# EAGLE design In-Palm_Manipulator (EAGLE 9.6.2)
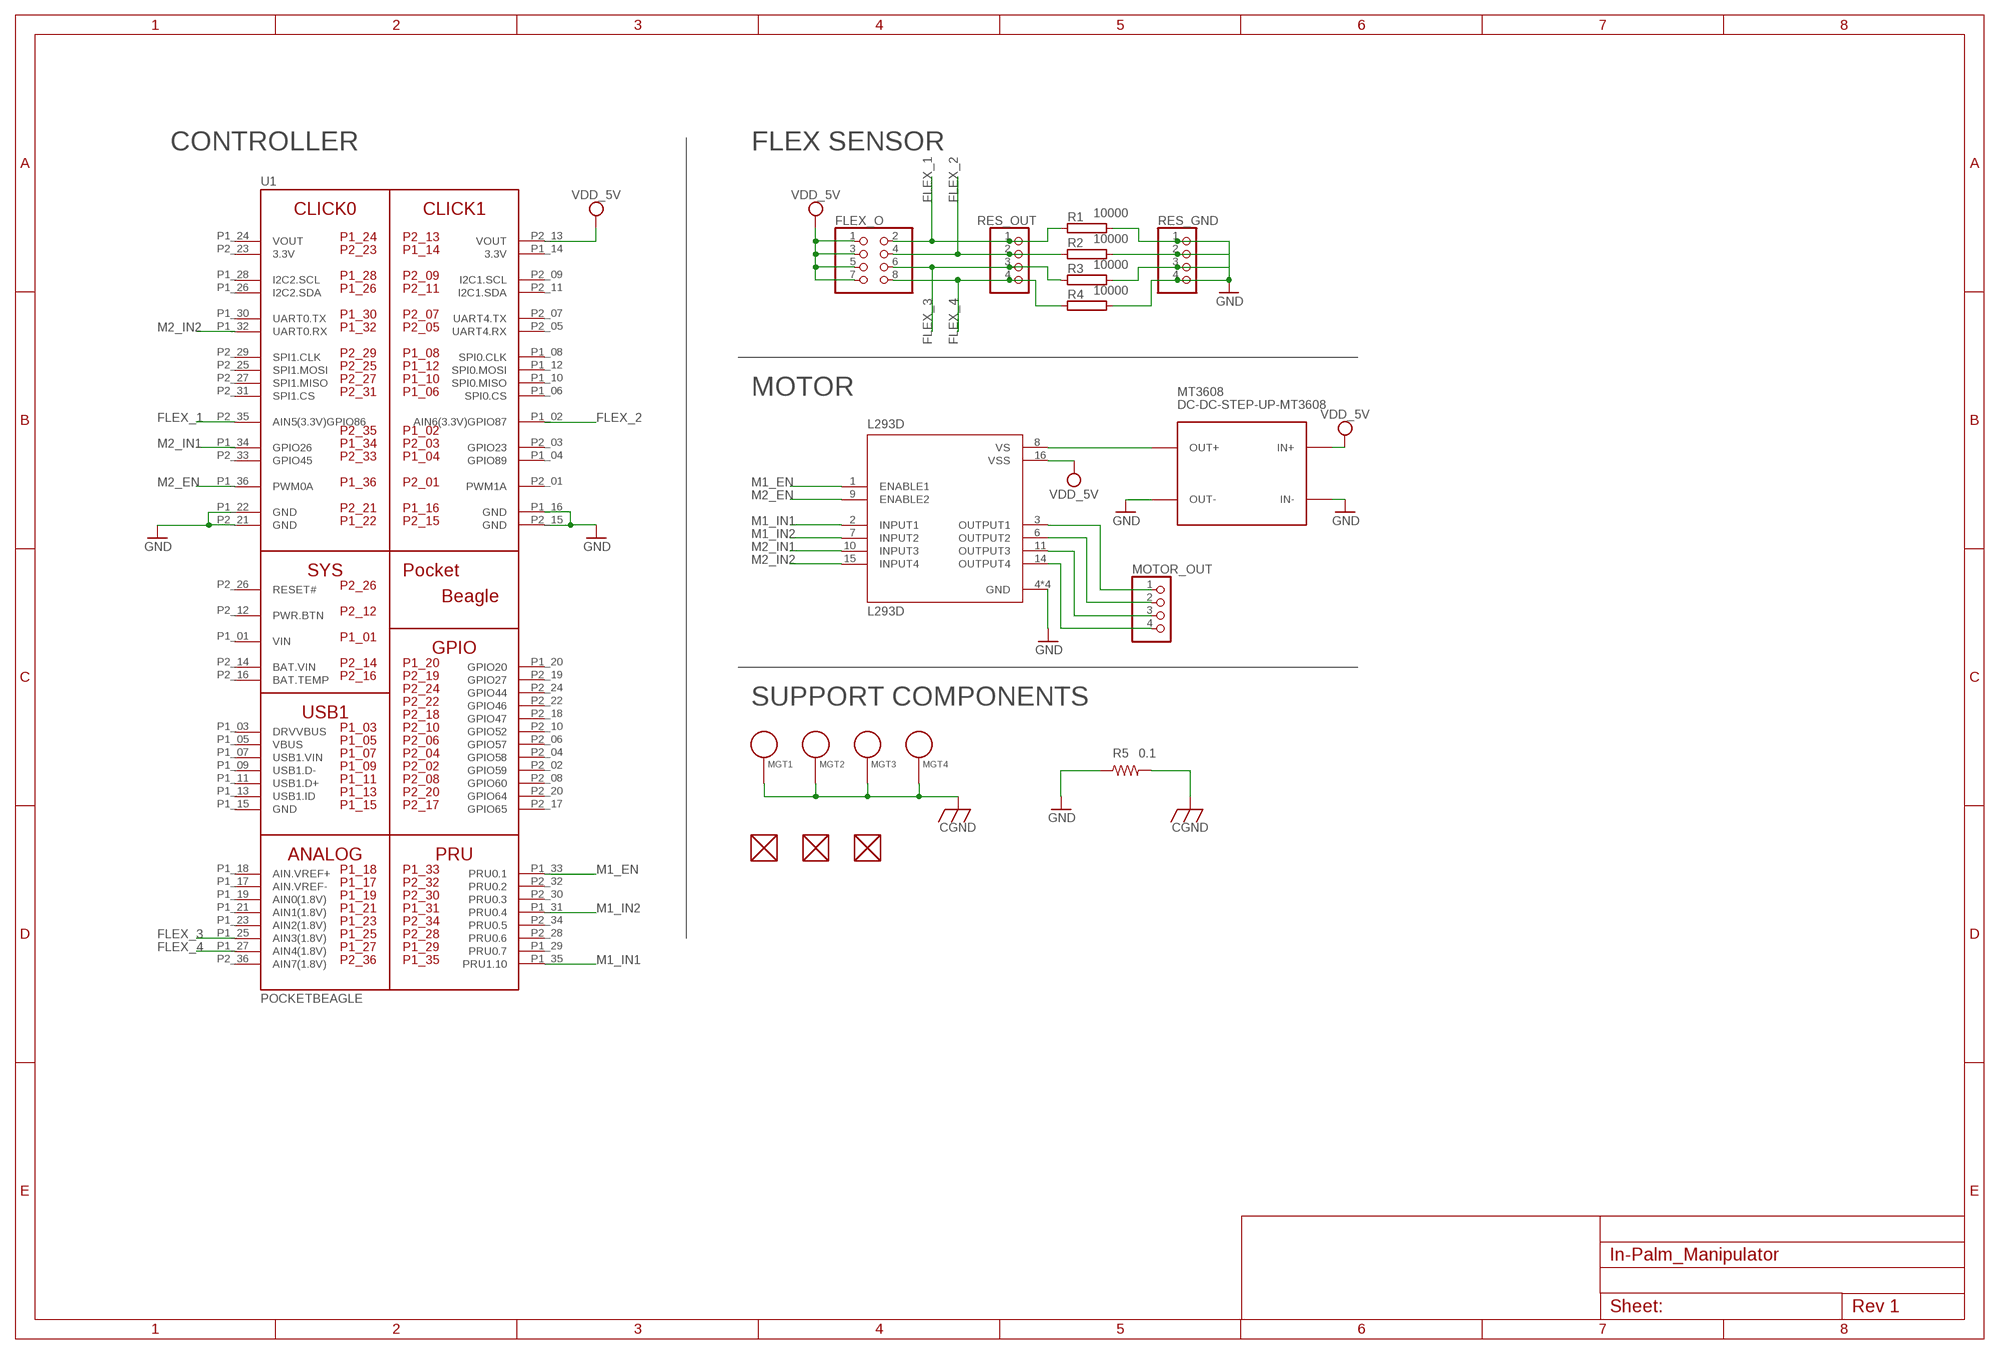
[diagram p0: schematic, sheet 1]

## Parts
FLEX_O  PINHD-2X4  [2X04]
FUD1  FIDUCIAL  [FIDUCIAL_40MIL]
FUD2  FIDUCIAL  [FIDUCIAL_40MIL]
FUD3  FIDUCIAL  [FIDUCIAL_40MIL]
L293D  L293D  [DIP880W50P254L2000H510Q16]
MGT1  MOUNTING_HOLE  [MOUNTING_HOLE]
MGT2  MOUNTING_HOLE  [MOUNTING_HOLE]
MGT3  MOUNTING_HOLE  [MOUNTING_HOLE]
MGT4  MOUNTING_HOLE  [MOUNTING_HOLE]
MOTOR_OUT  PINHD-1X4  [1X04]
MT3608  DC-DC-STEP-UP-MT3608  [DC-DC-STEP-UP-MT3608]
R1  10000  RHPS58  [HPS58]
R2  10000  RHPS58  [HPS58]
R3  10000  RHPS58  [HPS58]
R4  10000  RHPS58  [HPS58]
R5  0.1  R_R0603  [R0603]
RES_GND  PINHD-1X4  [1X04]
RES_OUT  PINHD-1X4  [1X04]
U1  POCKETBEAGLE  [POCKETBEAGLE]

## Nets
CGND: MGT1.P$1 MGT2.P$1 MGT3.P$1 MGT4.P$1 R5.2
FLEX_1: FLEX_O.2 R1.1 RES_OUT.1 U1.P2_35(AIN5(3.3V)GPIO86)
FLEX_2: FLEX_O.4 R2.1 RES_OUT.2 U1.P1_02(AIN6(3.3V)GPIO87)
FLEX_3: FLEX_O.6 R3.1 RES_OUT.3 U1.P1_25(AIN3(1.8V))
FLEX_4: FLEX_O.8 R4.1 RES_OUT.4 U1.P1_27(AIN4(1.8V))
GND: L293D.4(GND) L293D.5(GND) L293D.12(GND) L293D.13(GND) MT3608.IN- MT3608.OUT- R1.2 R2.2 R3.2 R4.2 R5.1 RES_GND.1 RES_GND.2 RES_GND.3 RES_GND.4 U1.P1_16(GND) U1.P1_22(GND) U1.P2_15(GND) U1.P2_21(GND)
M1_EN: L293D.1(ENABLE1) U1.P1_33(PRU0.1)
M1_IN1: L293D.2(INPUT1) U1.P1_35(PRU1.10)
M1_IN2: L293D.7(INPUT2) U1.P1_31(PRU0.4)
M2_EN: L293D.9(ENABLE2) U1.P1_36(PWM0A)
M2_IN1: L293D.10(INPUT3) U1.P1_34(GPIO26)
M2_IN2: L293D.15(INPUT4) U1.P1_32(UART0.RX)
N$1: L293D.8(VS) MT3608.OUT+
N$12: L293D.3(OUTPUT1) MOTOR_OUT.1
N$13: L293D.6(OUTPUT2) MOTOR_OUT.2
N$14: L293D.11(OUTPUT3) MOTOR_OUT.3
N$15: L293D.14(OUTPUT4) MOTOR_OUT.4
VDD_5V: FLEX_O.1 FLEX_O.3 FLEX_O.5 FLEX_O.7 L293D.16(VSS) MT3608.IN+ U1.P2_13(VOUT)
Unconnected: FUD1.P$1 FUD2.P$1 FUD3.P$1 U1.P1_03(DRVVBUS) U1.P1_04(GPIO89) U1.P1_05(VBUS) U1.P1_06(SPI0.CS) U1.P1_07(USB1.VIN) U1.P1_08(SPI0.CLK) U1.P1_09(USB1.D-) U1.P1_10(SPI0.MISO) U1.P1_11(USB1.D+) U1.P1_12(SPI0.MOSI) U1.P1_13(USB1.ID) U1.P1_15(GND) U1.P1_17(AIN.VREF-) U1.P1_18(AIN.VREF+) U1.P1_19(AIN0(1.8V)) U1.P1_20(GPIO20) U1.P1_21(AIN1(1.8V)) U1.P1_23(AIN2(1.8V)) U1.P1_26(I2C2.SDA) U1.P1_28(I2C2.SCL) U1.P1_29(PRU0.7) U1.P1_30(UART0.TX) U1.P2_01(PWM1A) U1.P2_02(GPIO59) U1.P2_03(GPIO23) U1.P2_04(GPIO58) U1.P2_05(UART4.RX) U1.P2_06(GPIO57) U1.P2_07(UART4.TX) U1.P2_08(GPIO60) U1.P2_09(I2C1.SCL) U1.P2_10(GPIO52) U1.P2_11(I2C1.SDA) U1.P2_12(PWR.BTN) U1.P2_16(BAT.TEMP) U1.P2_17(GPIO65) U1.P2_18(GPIO47) U1.P2_19(GPIO27) U1.P2_20(GPIO64) U1.P2_22(GPIO46) U1.P2_24(GPIO44) U1.P2_25(SPI1.MOSI) U1.P2_26(RESET#) U1.P2_27(SPI1.MISO) U1.P2_28(PRU0.6) U1.P2_29(SPI1.CLK) U1.P2_30(PRU0.3) U1.P2_31(SPI1.CS) U1.P2_32(PRU0.2) U1.P2_33(GPIO45) U1.P2_34(PRU0.5) U1.P2_36(AIN7(1.8V))

## Notes on the sheet
- CONTROLLER | FLEX SENSOR
- MOTOR
- SUPPORT COMPONENTS

## Power pins joined to a net without a drawn wire
3.3V: U1.P1_14(3.3V) U1.P2_23(3.3V)
BAT.VIN: U1.P2_14(BAT.VIN)
VIN: U1.P1_01(VIN)
VOUT: U1.P1_24(VOUT)

## Library data of the parts
FLEX_O = pinhead:PINHD-2X4: PIN HEADER
FUD1-FUD3 = combo_lock:FIDUCIAL
L293D = L293D:L293D: Check availability <https://pricing.snapeda.com/parts/L293D/STMicroelectronics/view-part?ref=eda>; AVAILABILITY: In Stock; CHECK_PRICES: https://www.snapeda.com/parts/L293D/STMicroelectronics/view-part/?ref=eda; DESCRIPTION: Bipolar Motor Driver - Parallel 16-PowerDIP; MF: STMicroelectronics; MP: L293D; PACKAGE: DIP-16 STMicroelectronics; PRICE: None; SNAPEDA_LINK: https://www.snapeda.com/parts/L293D/STMicroelectronics/view-part/?ref=snap
MGT1-MGT4 = combo_lock:MOUNTING_HOLE: Chassis Mounting Hole w/GND connection ability
MOTOR_OUT RES_GND RES_OUT = pinhead:PINHD-1X4: PIN HEADER
MT3608 = dc-dc-boost-2a-microusb-mt3608:DC-DC-STEP-UP-MT3608: DC/DC Step-Up Regulator based on MT3608 chip MT3608 datasheet available here: https://www.olimex.com/Products/Breadboarding/BB-PWR-3608/resources/MT3608.pdf Click here to find device on ebay.com <http://www.ebay.com/sch/mt3608+module>
R1-R4 = resistor-power:R: Power Resitor; OC_FARNELL: unknown; OC_NEWARK: unknown
R5 = combo_lock:R_: RESISTOR, American symbol
U1 = combo_lock:POCKETBEAGLE

## Board
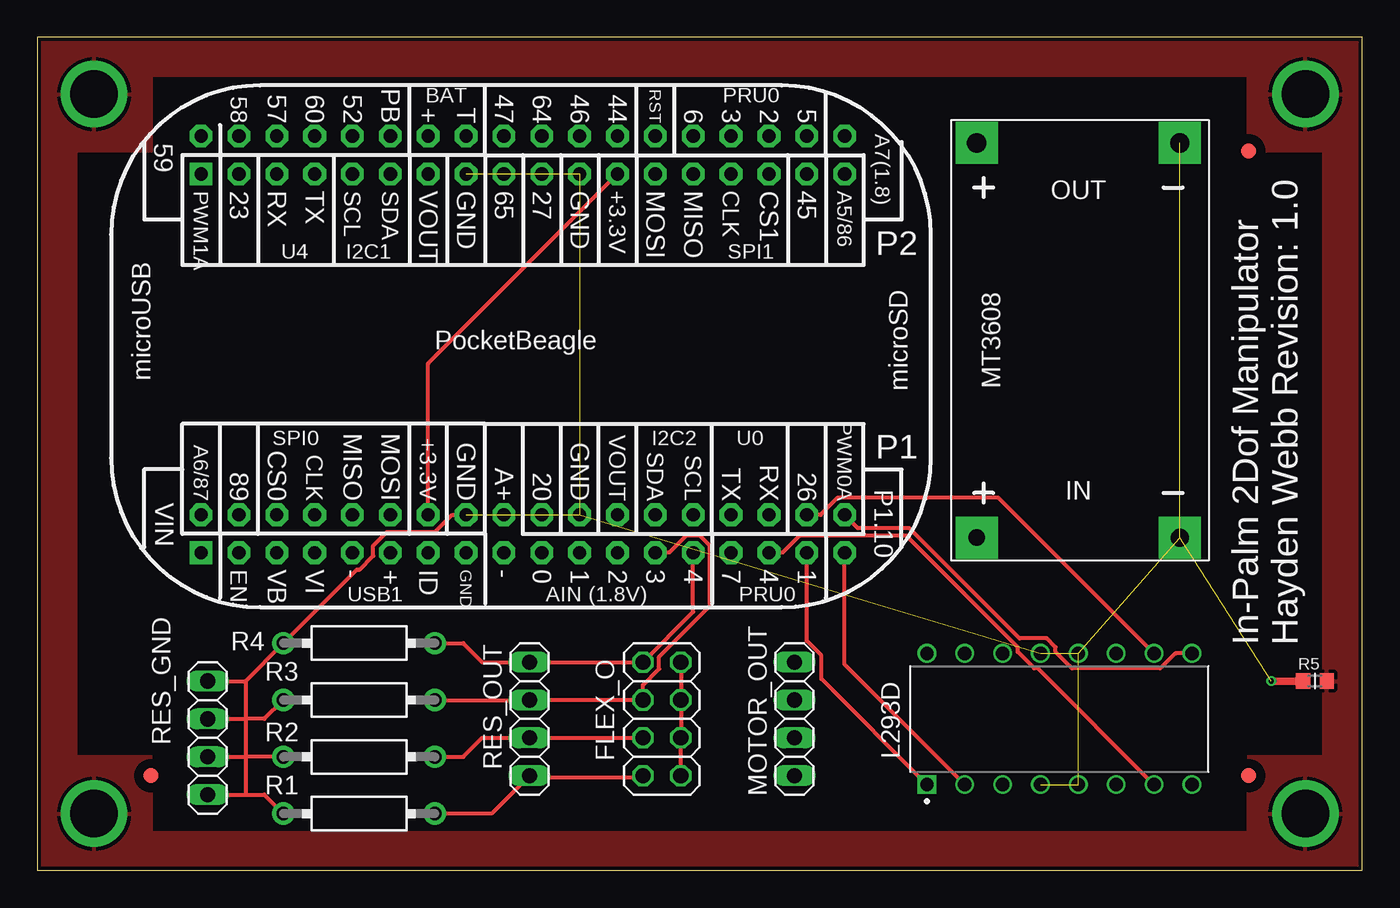
[diagram p1: board, top side]
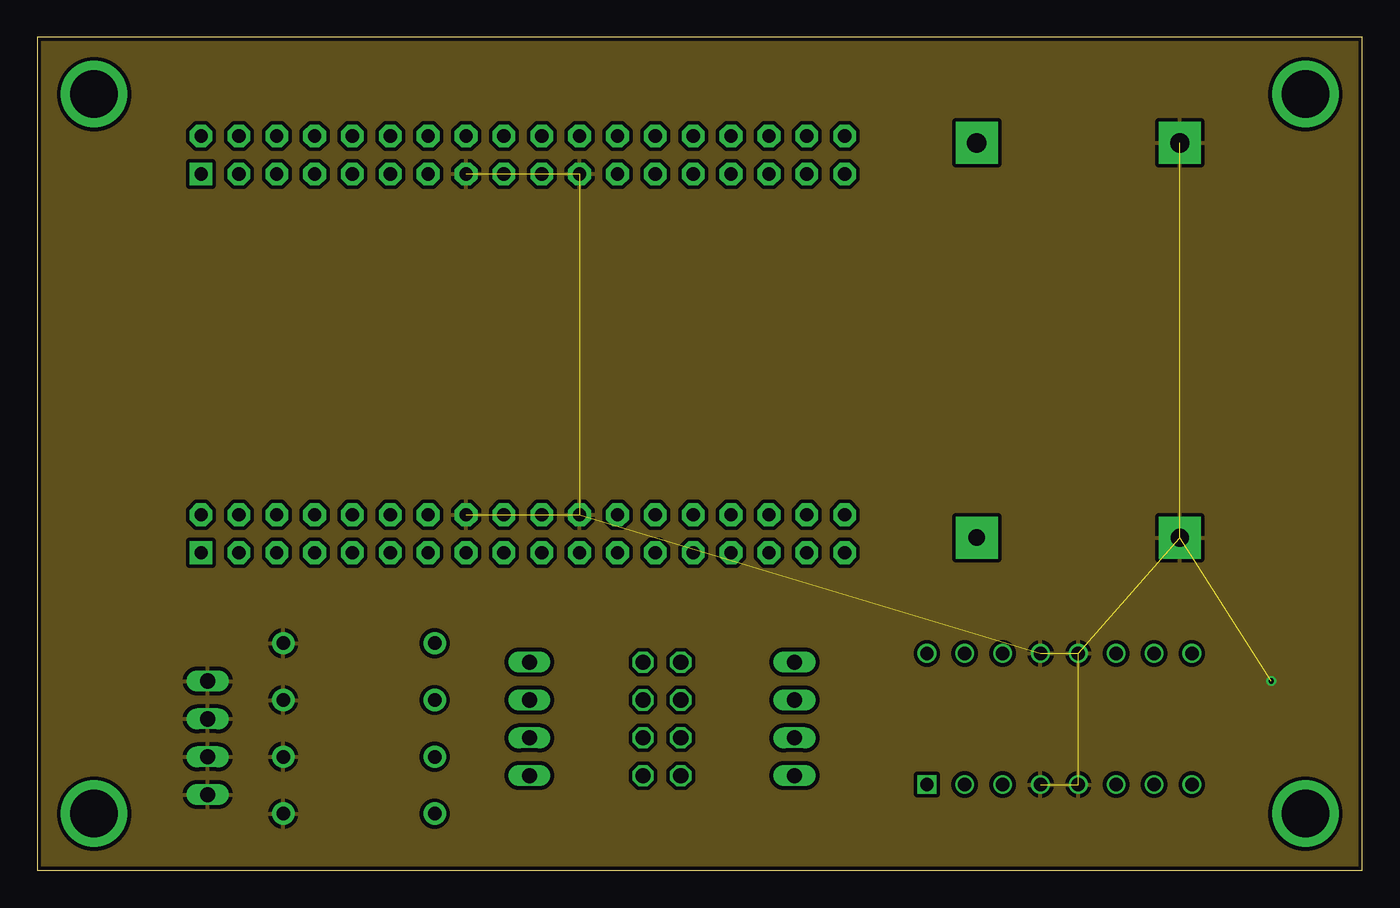
[diagram p2: board, inner layer Route2]
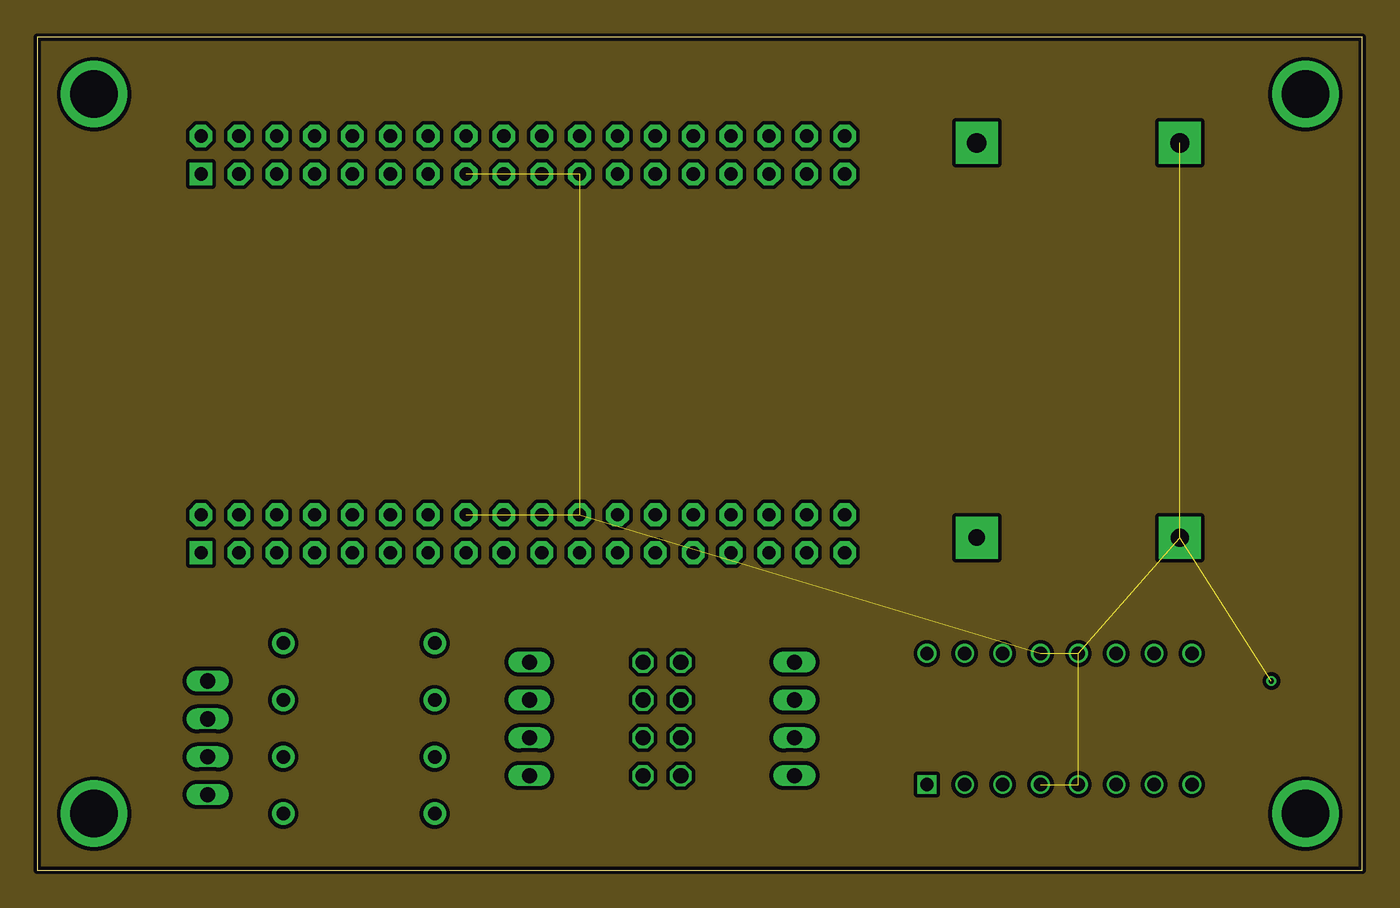
[diagram p3: board, inner layer Route15]
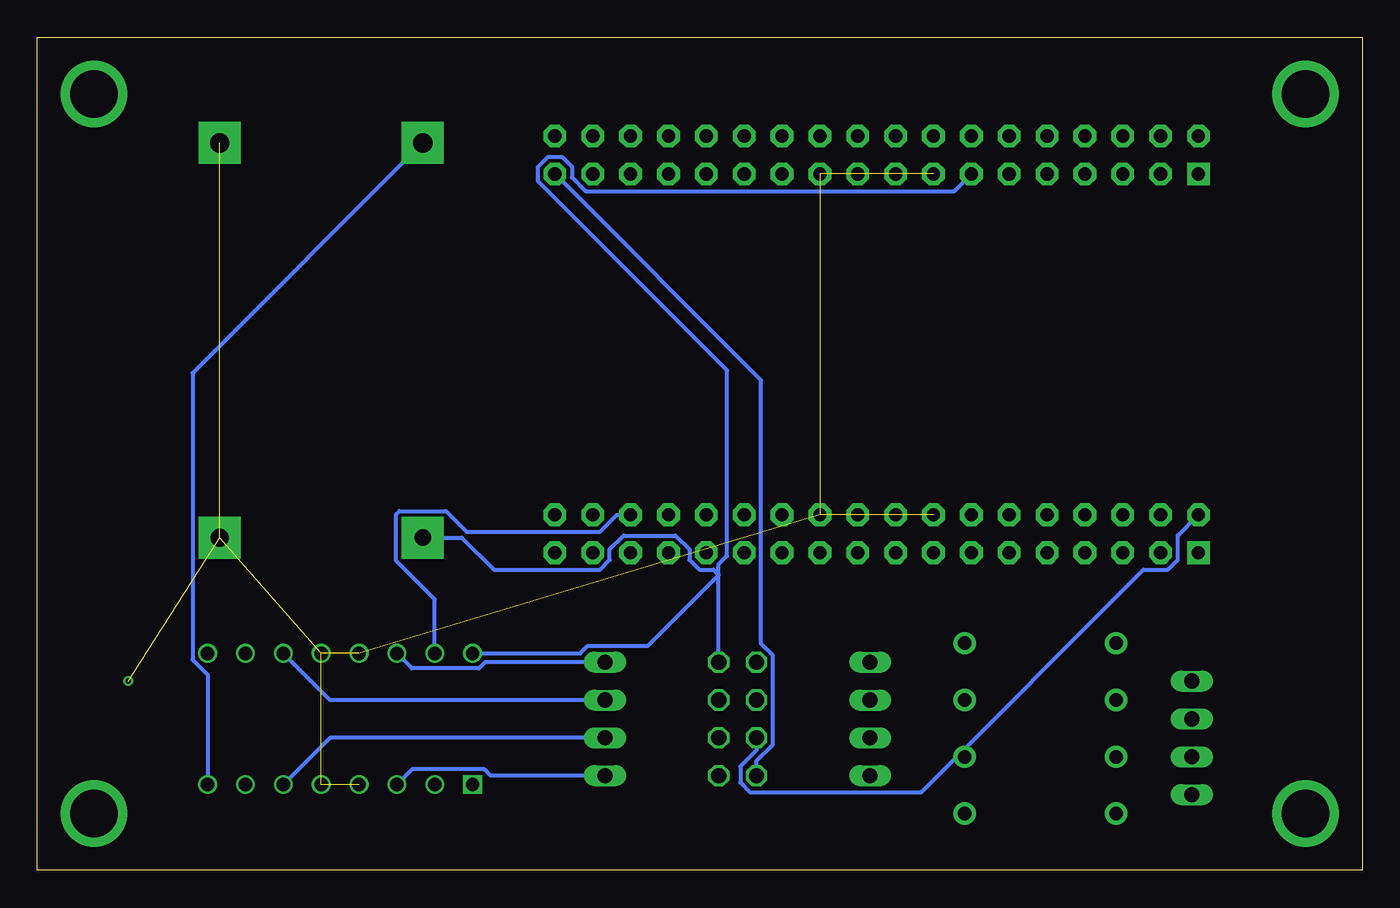
[diagram p4: board, bottom side, seen from below]

Size 88.9 x 55.88 mm. Coordinates in mm from the lower left corner, seen from the top.
Outline: 0,0 88.9,0 88.9,55.88 0,55.88 0,0
Copper layers (1*2*15*16): Top 0.035mm / dielectric 0.23mm / Route2 0.035mm / dielectric 0.93mm / Route15 0.035mm / dielectric 0.23mm / Bottom 0.035mm
Design rules "ENGI301_4lyr": minimum track width 10mil, minimum drill 12mil, track to track 10mil, track to pad 10mil, pad to pad 10mil, via to via 10mil, smd to smd 10mil, copper to edge 10mil, drill to drill 12mil, minimum pad ring 6mil, minimum via ring 6mil, stop-mask expansion 3mil, vias tented up to drill 25mil, thermal gap 10mil

### Footprints (pad centres in the part's own frame; a part is rotated, then mirrored left to right if it is on the bottom)
2X04 = drill 1.016 octagon: 1 -3.81,-1.27; 2 -3.81,1.27; 3 -1.27,-1.27; 4 -1.27,1.27; 5 1.27,-1.27; 6 1.27,1.27; 7 3.81,-1.27; 8 3.81,1.27
FIDUCIAL_40MIL = smd 1.016 x 1.016: P$1 0,0
DIP880W50P254L2000H510Q16 = drill 0.9 pad 1.25 square: 1 -4.4,8.89 | drill 0.9 pad 1.25: 2 -4.4,6.35; 3 -4.4,3.81; 4 -4.4,1.27; 5 -4.4,-1.27; 6 -4.4,-3.81; 7 -4.4,-6.35; 8 -4.4,-8.89; 9 4.4,-8.89; 10 4.4,-6.35; 11 4.4,-3.81; 12 4.4,-1.27; 13 4.4,1.27; 14 4.4,3.81; 15 4.4,6.35; 16 4.4,8.89
MOUNTING_HOLE = drill 3.175 pad 4.445: P$1 0,0
1X04 = drill 1.016 long: 1 -3.81,0; 2 -1.27,0; 3 1.27,0; 4 3.81,0
DC-DC-STEP-UP-MT3608 = drill 1.1 pad 2.8 square: IN+ -13.24,6.81 | drill 1.2 pad 2.8 square: IN- -13.24,-6.81 | drill 1.3 pad 2.8 square: OUT+ 13.24,6.81; OUT- 13.24,-6.81
HPS58 = drill 0.9 pad 1.5: 1 -5.08,0; 2 5.08,0
R0603 = smd 0.95 x 1.031: 1 -0.8,0; 2 0.8,0
POCKETBEAGLE = drill 0.889 pad 1.524 square: P1_01 5.91,3.53; P2_01 5.91,28.93 | drill 0.889 pad 1.524 octagon: P1_02 5.91,6.07; P1_03 8.45,3.53; P1_04 8.45,6.07; P1_05 10.99,3.53; P1_06 10.99,6.07; P1_07 13.53,3.53; P1_08 13.53,6.07; P1_09 16.07,3.53; P1_10 16.07,6.07; P1_11 18.61,3.53; P1_12 18.61,6.07; P1_13 21.15,3.53; P1_14 21.15,6.07; P1_15 23.69,3.53; P1_16 23.69,6.07; P1_17 26.23,3.53; P1_18 26.23,6.07; P1_19 28.77,3.53; P1_20 28.77,6.07; P1_21 31.31,3.53; P1_22 31.31,6.07; P1_23 33.85,3.53; P1_24 33.85,6.07; P1_25 36.39,3.53; P1_26 36.39,6.07; P1_27 38.93,3.53; P1_28 38.93,6.07; P1_29 41.47,3.53; P1_30 41.47,6.07; P1_31 44.01,3.53; P1_32 44.01,6.07; P1_33 46.55,3.53; P1_34 46.55,6.07; P1_35 49.09,3.53; P1_36 49.09,6.07; P2_02 5.91,31.47; P2_03 8.45,28.93; P2_04 8.45,31.47; P2_05 10.99,28.93; P2_06 10.99,31.47; P2_07 13.53,28.93; P2_08 13.53,31.47; P2_09 16.07,28.93; P2_10 16.07,31.47; P2_11 18.61,28.93; P2_12 18.61,31.47; P2_13 21.15,28.93; P2_14 21.15,31.47; P2_15 23.69,28.93; P2_16 23.69,31.47; P2_17 26.23,28.93; P2_18 26.23,31.47; P2_19 28.77,28.93; P2_20 28.77,31.47; P2_21 31.31,28.93; P2_22 31.31,31.47; P2_23 33.85,28.93; P2_24 33.85,31.47; P2_25 36.39,28.93; P2_26 36.39,31.47; P2_27 38.93,28.93; P2_28 38.93,31.47; P2_29 41.47,28.93; P2_30 41.47,31.47; P2_31 44.01,28.93; P2_32 44.01,31.47; P2_33 46.55,28.93; P2_34 46.55,31.47; P2_35 49.09,28.93; P2_36 49.09,31.47

### Placement (x,y rotation side)
FLEX_O  41.91,10.16 90 top
FUD1  7.62,6.35 0 top
FUD2  81.28,6.35 0 top
FUD3  81.28,48.26 0 top
L293D  68.58,10.16 90 top
MGT1  3.81,3.81 0 top
MGT2  3.81,52.07 0 top
MGT3  85.09,52.07 0 top
MGT4  85.09,3.81 0 top
MOTOR_OUT  50.8,10.16 90 top
MT3608  69.85,35.56 90 top
R1  21.59,3.81 180 top
R2  21.59,7.62 180 top
R3  21.59,11.43 180 top
R4  21.59,15.24 180 top
R5  85.72,12.7 0 top
RES_GND  11.43,8.89 90 top
RES_OUT  33.02,10.16 90 top
U1  5.08,17.78 0 top

### Tracks (layer width: path | path; a pad name or v marks a point on that pad's centre or on a via)
3.3V
  Top 0.254: U1.P1_14 26.23,34.01 U1.P2_23
CGND
  pour Top: -1.27,27.94 2.54,27.94 2.54,7.62 7.62,7.62 7.62,2.54 81.28,2.54 81.28,7.62 86.36,7.62 86.36,27.94 91.44,27.94 91.44,-1.27 -1.27,-1.27
  pour Top: -1.27,27.94 -1.27,57.15 91.44,57.15 91.44,27.94 86.36,27.94 86.36,48.26 81.28,48.26 81.28,53.34 7.62,53.34 7.62,48.26 2.54,48.26 2.54,27.94
FLEX_1
  Top 0.254: RES_OUT.1 32.89,6.22 | 32.89,6.22 30.48,3.81 R1.1 | FLEX_O.2 40.51,6.22 32.89,6.22
  Bottom 0.254: FLEX_O.2 40.64,7.34 39.55,8.44 39.55,14.42 40.33,15.2 40.33,32.87 U1.P2_35
FLEX_2
  Top 0.254: R2.1 28.57,7.62 29.84,8.89 RES_OUT.2 FLEX_O.4
  Bottom 0.254: U1.P1_02 12.39,22.45 12.39,20.84 13.06,20.17 14.67,20.17 29.58,5.26 41.09,5.26 41.73,5.9 41.73,6.97 40.64,8.06 FLEX_O.4
FLEX_3
  Top 0.254: R3.1 RES_OUT.3 FLEX_O.6 40.64,12.43 41.73,13.52 41.73,14.34 45.15,17.77 45.15,21.78 44.48,22.45 43.54,22.45 42.39,21.31 U1.P1_25
FLEX_4
  Top 0.254: R4.1 28.57,15.24 29.84,13.97 RES_OUT.4 FLEX_O.8 44.01,17.34 U1.P1_27
GND  (via drill 0.35)  (10 unrouted)
  Top 0.254: RES_GND.4 13.97,12.7 | 13.97,12.7 R4.2 21.44,20.17 21.62,20.17 22.55,21.09 22.55,21.78 23.47,22.71 26.7,22.71 27.85,23.85 U1.P1_16 | R3.2 15.24,10.16 13.97,10.16 | RES_GND.3 13.97,10.16 | RES_GND.2 13.97,7.62 | R2.2 13.97,7.62 | RES_GND.1 13.97,5.08 | 13.97,5.08 15.24,5.08 R1.2 | 13.97,12.7 13.97,10.16 | 13.97,10.16 13.97,7.62 | 13.97,7.62 13.97,5.08
  Top 0.508: R5.1 v82.8,12.7
  pour Route2: -2.54,-2.54 92.71,-2.54 92.71,58.42 -2.54,58.42
M1_EN
  Top 0.254: L293D.1 52.6,12.85 52.6,14.42 51.63,15.4 U1.P1_33
M1_IN1
  Top 0.254: L293D.2 54.17,13.82 U1.P1_35
M1_IN2
  Top 0.254: L293D.7 67.14,13.55 66.89,13.55 65.78,14.66 65.78,14.98 58.31,22.45 51.16,22.45 50.01,21.31 U1.P1_31
M2_EN
  Top 0.254: U1.P1_36 55.06,22.96 58.52,22.96 65.91,15.57 67.73,15.57 68.32,14.98 68.32,14.66 69.43,13.55 75.35,13.55 76.36,14.56 L293D.9
M2_IN1
  Top 0.254: U1.P1_34 52.55,23.85 53.7,24.99 64.5,24.99 L293D.10
M2_IN2
  Bottom 0.254: U1.P1_32 50.01,23.85 51.16,22.71 60.09,22.71 61.48,24.1 64.6,24.1 64.82,23.88 64.82,20.76 62.23,18.17 L293D.15
N$1
  Bottom 0.254: L293D.8 77.47,13.13 78.48,14.14 78.48,33.36 MT3608.OUT+
N$12
  Bottom 0.254: MOTOR_OUT.1 58.48,6.35 58.9,6.77 63.76,6.77 L293D.3
N$13
  Bottom 0.254: MOTOR_OUT.2 69.26,8.89 L293D.6
N$14
  Bottom 0.254: MOTOR_OUT.3 69.26,11.43 L293D.11
N$15
  Bottom 0.254: MOTOR_OUT.4 58.85,13.97 59.27,13.55 63.76,13.55 L293D.14
VDD_3P3V
  pour Route15: -3.81,-3.81 -3.81,59.69 93.98,59.69 93.98,-3.81
VDD_5V
  Top 0.254: FLEX_O.1 FLEX_O.3 FLEX_O.5 FLEX_O.7
  Bottom 0.254: FLEX_O.7 43.18,19.81 | 43.18,19.81 43.18,20.52 42.61,21.09 42.61,33.54 55.31,46.24 55.31,47.18 54.64,47.85 53.7,47.85 53.03,47.18 53.03,46.49 52.1,45.57 27.37,45.57 U1.P2_13 | L293D.16 52.47,14.56 51.96,15.06 47.93,15.06 43.18,19.81 | MT3608.IN+ 60.42,22.32 58.27,20.17 51.16,20.17 50.49,20.84 50.49,21.53 49.56,22.45 46.08,22.45 45.15,21.53 45.15,20.84 44.48,20.17 43.53,20.17 43.18,19.81

### Text on the board
tPlace: In-Palm 2Dof Manipulator / Hayden Webb Revision: 1.0